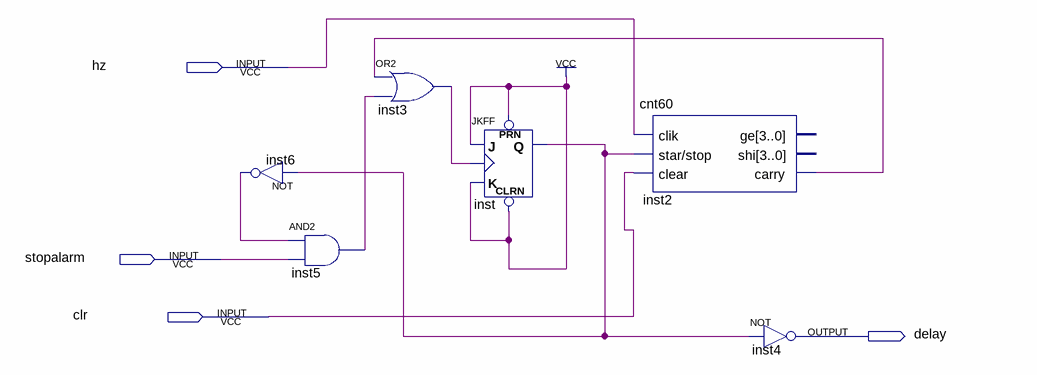
[diagram p0: schematic sheet]
// Quartus schematic timedelay.bdf as structural Verilog: 6 symbols, 4 pins
module timedelay (
  input  hz,
  input  stopalarm,
  input  clr,
  output delay
);

  wire inst2_carry, inst3_out, inst5_out, inst6_out, inst_q;

  not inst6 (inst6_out, inst_q);
  and inst5 (inst5_out, inst6_out, stopalarm);
  or inst3 (inst3_out, inst2_carry, inst5_out);
  JKFF inst (.PRN(1'b1), .CLRN(1'b1), .K(1'b1), .J(1'b1), .CLK(inst3_out), .Q(inst_q));
  cnt60 inst2 (.clik(hz), .\star/stop (inst_q), .clear(clr), .carry(inst2_carry));  // open: ge, shi
  not inst4 (delay, inst_q);
endmodule
